# EAGLE design Main_Camera_Board7_with_holes (EAGLE 7.6.0)
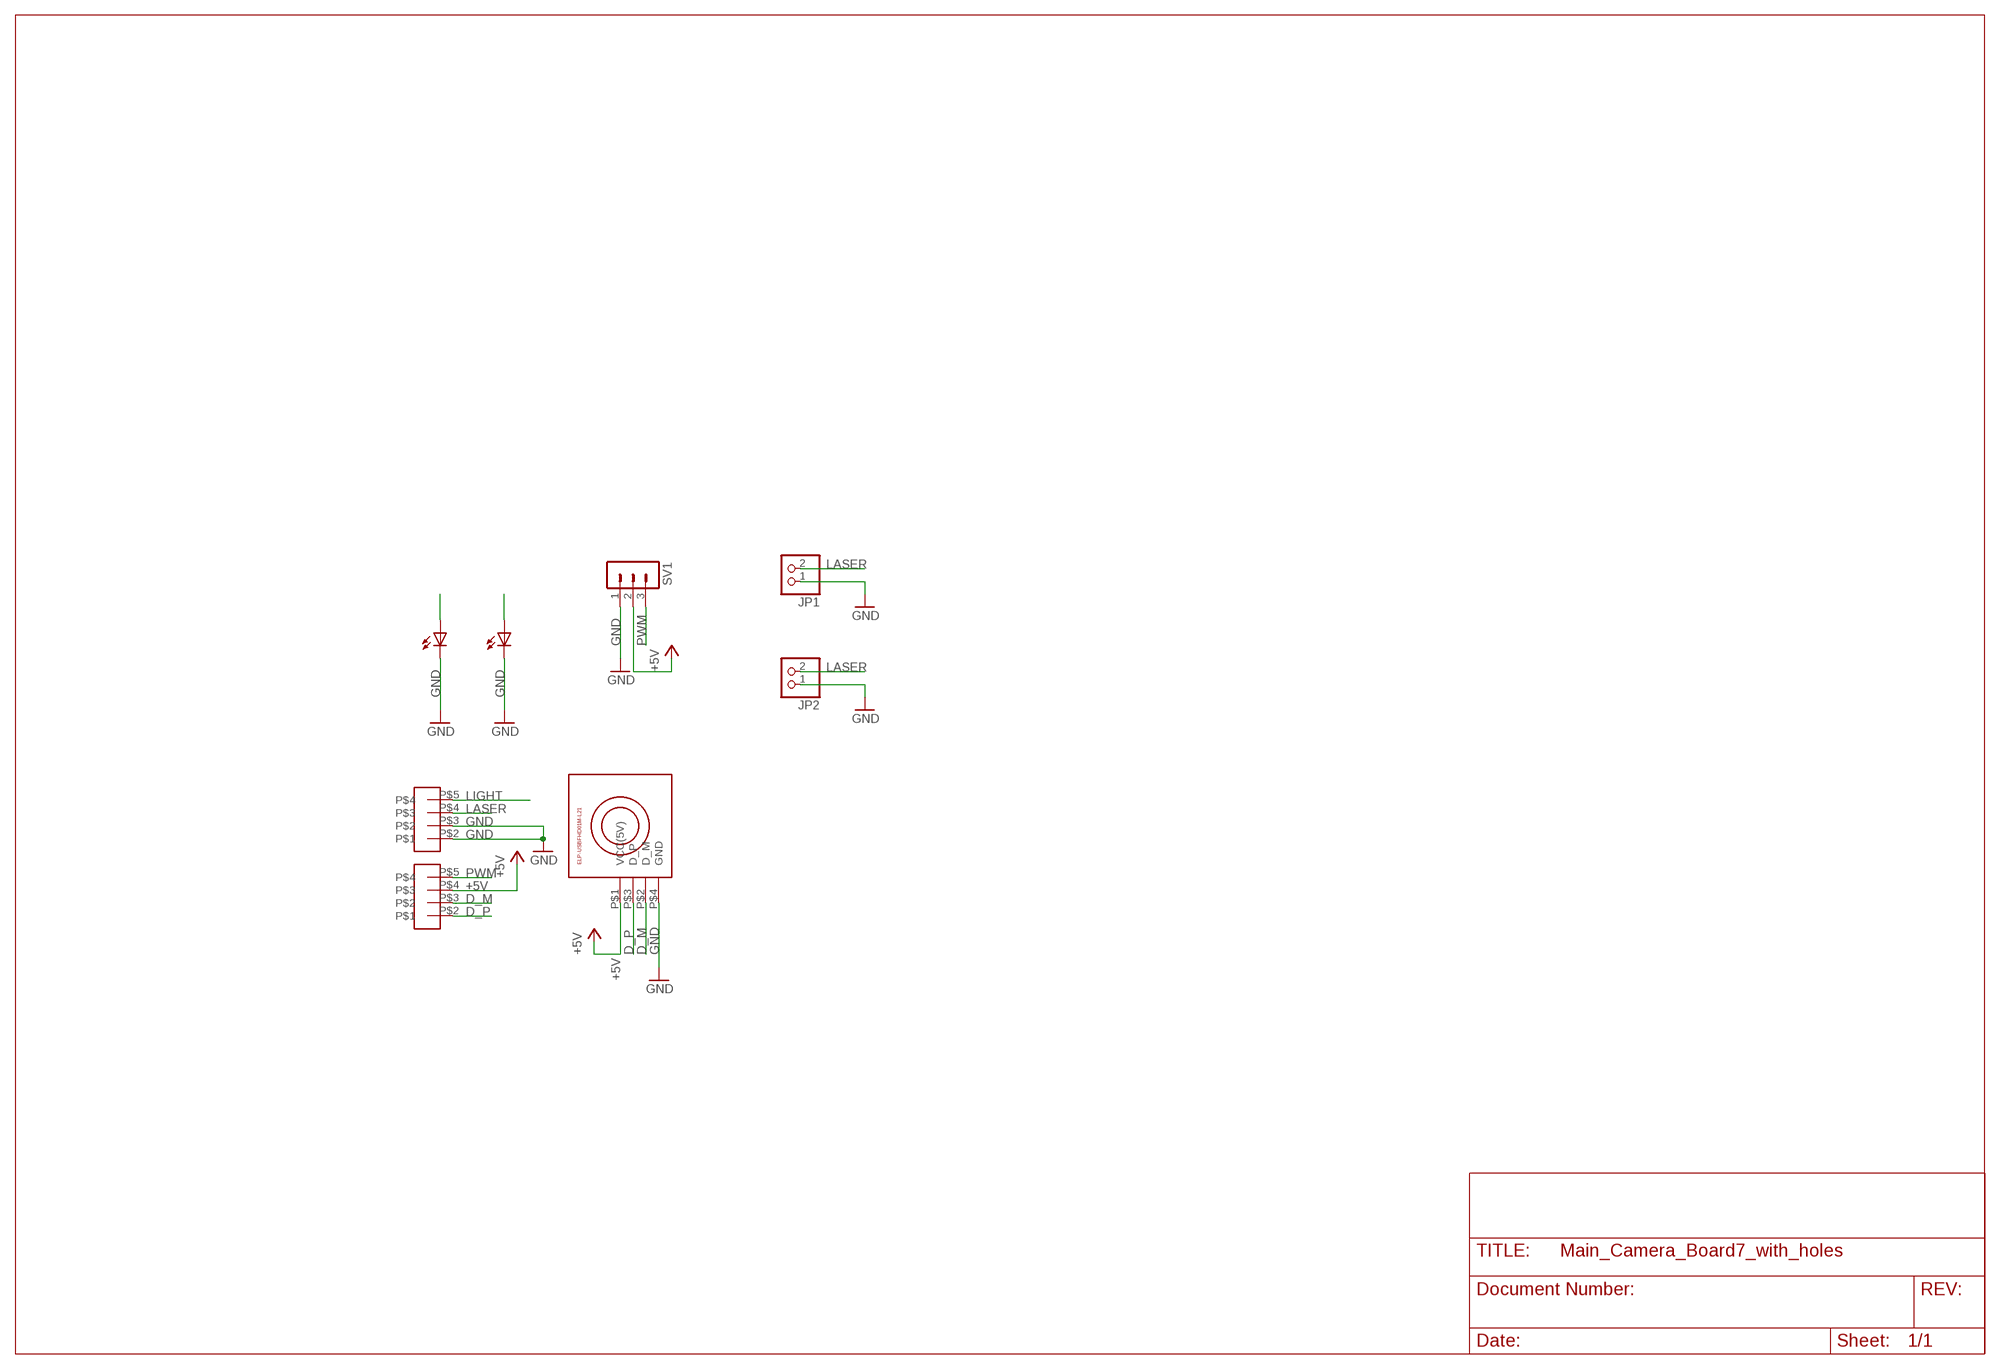
[diagram p0: schematic, sheet 1]

## Parts
JP1  PINHD-1X2  [1X02]
JP2  PINHD-1X2  [1X02]
SV1  MA03-1  [MA03-1]
U$1  ELP-USBFHD01M-L21  [ELP-USBFHD01M-L21]
U$2  LED  [LED]
U$3  LED  [LED]
U$4  T21  [T2I]
U$5  T21  [T2I]

## Nets
+5V: SV1.2 U$1.P$1(VCC(5V)) U$5.P$4
D_M: U$1.P$2(D_M) U$5.P$3
D_P: U$1.P$3(D_P) U$5.P$2
GND: JP1.1 JP2.1 SV1.1 U$1.P$4(GND) U$2.P$1(CATHODE) U$2.P$3(CATHODE) U$3.P$1(CATHODE) U$3.P$3(CATHODE) U$4.P$2 U$4.P$3
LASER: JP1.2 JP2.2 U$4.P$4
LIGHT: U$2.P$2(ANODE) U$3.P$2(ANODE) U$4.P$5
PWM: SV1.3 U$5.P$5

## Library data of the parts
JP1 JP2 = pinhead:PINHD-1X2: PIN HEADER
SV1 = con-lstb:MA03-1: PIN HEADER; OC_FARNELL: unknown; OC_NEWARK: unknown
U$1 = camera:ELP-USBFHD01M-L21
U$2 U$3 = camera:LED
U$4 U$5 = camera:T21

## Board
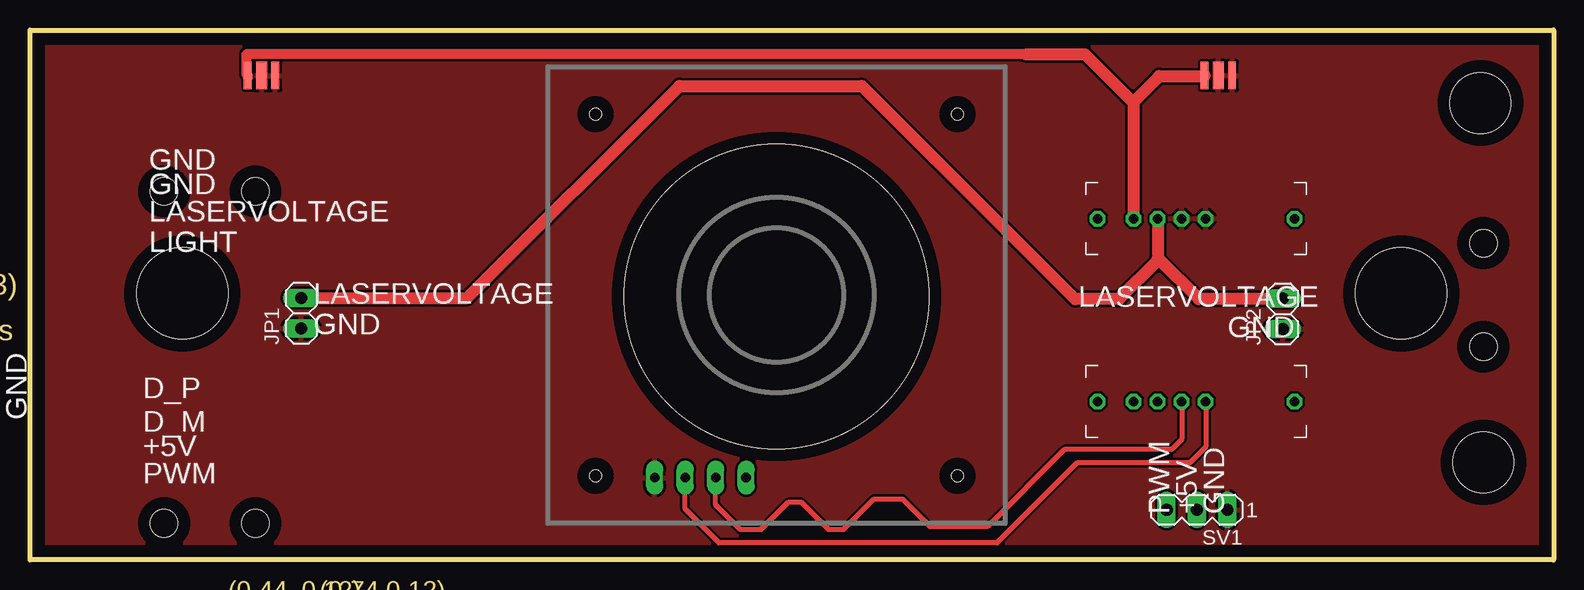
[diagram p1: board, top side]
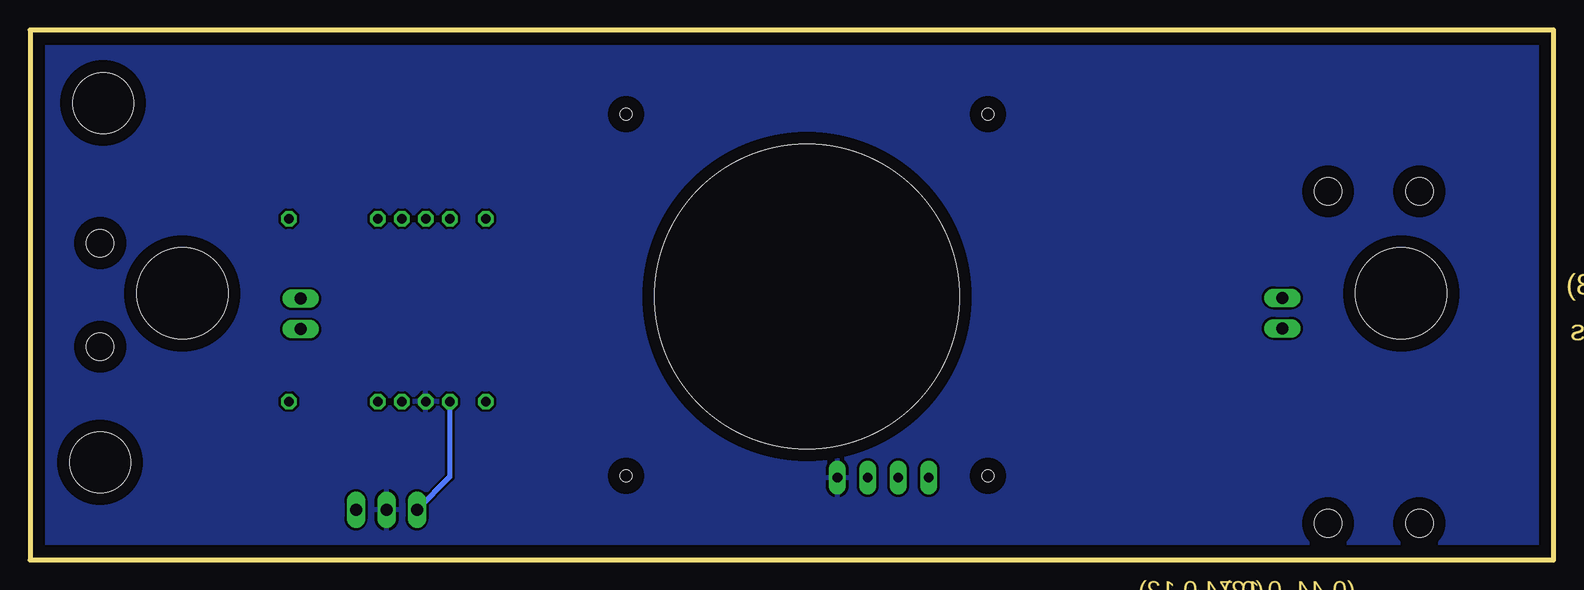
[diagram p2: board, bottom side, seen from below]

Size 127 x 44.2 mm. Coordinates in mm from the lower left corner, seen from the top.
Outline: 0,44.2 127,44.2 127,0 0,0 0,44.2
Copper layers (1*16): Top 0.035mm / dielectric 1.5mm / Bottom 0.035mm
Design rules "default": minimum track width 10mil, minimum drill 24mil, track to track 8mil, track to pad 8mil, pad to pad 8mil, via to via 8mil, smd to smd 8mil, copper to edge 40mil, drill to drill 8mil, minimum pad ring 10mil, minimum via ring 8mil, stop-mask expansion 4mil, vias tented up to drill 0mil, thermal gap 10mil
Holes 25.4 mm at 62.23,21.97
Holes 2.29 mm at 11.18,3.05 18.8,3.05 11.18,30.73 18.8,30.73 121.16,26.42 121.16,17.78
Holes 7.62 mm at 114.3,22.23 12.7,22.23
Holes 5.08 mm at 120.9,38.1 121.16,8.13

### Footprints (pad centres in the part's own frame; a part is rotated, then mirrored left to right if it is on the bottom)
1X02 = drill 1.016 long: 1 -1.27,0; 2 1.27,0
MA03-1 = drill 1.016 long: 1 -2.54,0; 2 0,0; 3 2.54,0
ELP-USBFHD01M-L21 = drill 0.8 pad 1.422 long: P$1 -2.54,-13.97; P$2 -5.08,-13.97; P$3 -7.62,-13.97; P$4 -10.16,-13.97 | hole 0.992: -15.081,16.351; 15.081,16.351; -15.081,-13.811; 15.081,-13.811
LED = smd 0.92 x 2.29: P$1 0,0 | smd 0.66 x 2.29: P$2 -1.15,0; P$3 1.15,0
T2I = drill 0.8 pad 1.27 octagon: P$1 0,0; P$2 7.4,0; P$3 9.4,0; P$4 11.4,0; P$5 13.4,0; P$6 16.4,0

### Placement (x,y rotation side)
JP1  22.61,20.57 90 top
JP2  104.43,20.53 90 top
SV1  97.28,4.18 180 top
U$1  62.23,20.83 0 top
U$2  19.3,40.39 0 top
U$3  99.06,40.39 0 top
U$4  105.41,28.45 180 top
U$5  105.41,13.21 180 top

### Tracks (layer width: path | path; a pad name or v marks a point on that pad's centre or on a via)
+5V
  pour Bottom: 0,0 127,0 127,44.2 0,44.2
D_M
  Top 0.406: U$5.P$3 96.01,10.04 95.17,9.2 86.24,9.2 79.81,2.77 75.05,2.77 72.74,5.08 70.36,5.08 67.82,2.54 66.55,2.54 64.26,4.83 63.25,4.83 60.95,2.53 59.19,2.53 57.15,4.57 U$1.P$2
D_P
  Top 0.406: U$5.P$2 98.01,9.42 96.68,8.09 87.27,8.09 80.61,1.42 57.43,1.42 54.61,4.24 U$1.P$3
GND
  pour Top: 0,44.2 127,44.2 127,0 0,0
LASER
  Top 1.016: JP1.2 36.46,21.84 54.13,39.52 69.33,39.52 87.11,21.74 90.79,21.74 94.01,24.96 | JP2.2 104.37,21.74 97.42,21.74 94.01,25.15 | U$4.P$4 94.01,25.15 | 94.01,25.15 94.01,24.96 | 94.01,24.96 94.02,24.96
LIGHT
  Top 0.813: 83.06,42.16 18.03,42.16 18.03,40.51 U$2.P$2 18.15,40.25
  Top 1.016: U$4.P$5 92.01,37.12 | 92.01,37.12 92,37.14 | 92.01,37.12 92.01,38.09 | 92.01,38.09 92.01,38.22 94.14,40.35 97.88,40.35 U$3.P$2 | 92.01,38.09 87.94,42.16 83.06,42.16
PWM
  Bottom 0.406: U$5.P$5 92.01,6.91 SV1.3

### Text on the board
Dimension: (same as bottom,0.53 from top) | (0.20 from the edge, 0.7 from the top) | (lasers 0.875, diameter 0.3) | (lasers 0.875, diameter 0.3) | coincident with lasers | coincident with lasers | (0.44, 0.12) | (0.74,0.12) | (0.2, 0.7 from the bottom) | hole diameter: 0.09
tNames: GND | GND | LASERVOLTAGE | LIGHT | LASERVOLTAGE | LASERVOLTAGE | GND | GND | D_P | GND | D_M | +5V | PWM | PWM | +5V | GND
tDocu: 5 in x 1.74 in